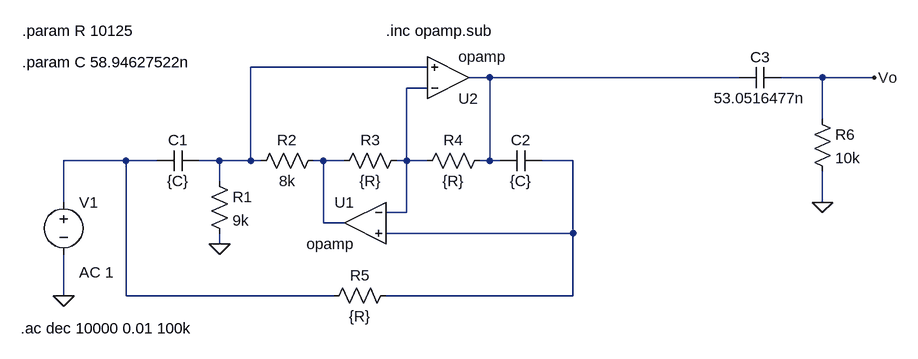
[diagram p0: schematic TS6.asc]
TS6.asc, the LTspice schematic file:
Version 4
SHEET 1 1136 680
WIRE 400 -16 128 -16
WIRE 496 0 464 0
WIRE 880 0 496 0
WIRE 1008 0 944 0
WIRE 1088 0 1008 0
WIRE 400 16 368 16
WIRE 1008 64 1008 0
WIRE -64 128 -160 128
WIRE -16 128 -64 128
WIRE 80 128 48 128
WIRE 128 128 128 -16
WIRE 128 128 80 128
WIRE 144 128 128 128
WIRE 240 128 224 128
WIRE 272 128 240 128
WIRE 368 128 368 16
WIRE 368 128 352 128
WIRE 400 128 368 128
WIRE 496 128 496 0
WIRE 496 128 480 128
WIRE 512 128 496 128
WIRE 624 128 576 128
WIRE 80 160 80 128
WIRE -160 192 -160 128
WIRE 1008 192 1008 144
WIRE 368 208 368 128
WIRE 368 208 336 208
WIRE 240 224 240 128
WIRE 272 224 240 224
WIRE 624 240 624 128
WIRE 624 240 336 240
WIRE 80 256 80 240
WIRE -160 336 -160 272
WIRE -64 336 -64 128
WIRE 256 336 -64 336
WIRE 624 336 624 240
WIRE 624 336 336 336
FLAG 80 256 0
FLAG -160 336 0
FLAG 1008 192 0
FLAG 1088 0 Vo
SYMBOL cap 48 112 R90
WINDOW 0 0 32 VBottom 2
WINDOW 3 32 32 VTop 2
SYMATTR InstName C1
SYMATTR Value {C}
SYMBOL res 64 144 R0
SYMATTR InstName R1
SYMATTR Value 9k
SYMBOL res 240 112 R90
WINDOW 0 0 56 VBottom 2
WINDOW 3 32 56 VTop 2
SYMATTR InstName R2
SYMATTR Value 8k
SYMBOL res 368 112 R90
WINDOW 0 0 56 VBottom 2
WINDOW 3 32 56 VTop 2
SYMATTR InstName R3
SYMATTR Value {R}
SYMBOL res 496 112 R90
WINDOW 0 0 56 VBottom 2
WINDOW 3 32 56 VTop 2
SYMATTR InstName R4
SYMATTR Value {R}
SYMBOL cap 576 112 R90
WINDOW 0 0 32 VBottom 2
WINDOW 3 32 32 VTop 2
SYMATTR InstName C2
SYMATTR Value {C}
SYMBOL res 352 320 R90
WINDOW 0 0 56 VBottom 2
WINDOW 3 32 56 VTop 2
SYMATTR InstName R5
SYMATTR Value {R}
SYMBOL OpAmps\\opamp 304 160 M0
SYMATTR InstName U1
SYMATTR SpiceLine Aol=10000Meg
SYMATTR SpiceLine2 GBW=1000Meg
SYMBOL OpAmps\\opamp 432 64 M180
SYMATTR InstName U2
SYMATTR SpiceLine Aol=10000Meg
SYMATTR SpiceLine2 GBW=1000Meg
SYMBOL voltage -160 176 R0
WINDOW 123 24 124 Left 2
WINDOW 39 0 0 Left 0
SYMATTR InstName V1
SYMATTR Value ""
SYMATTR Value2 AC 1
SYMBOL cap 944 -16 R90
WINDOW 0 0 32 VBottom 2
WINDOW 3 32 32 VTop 2
SYMATTR InstName C3
SYMATTR Value 53.0516477n
SYMBOL res 992 48 R0
SYMATTR InstName R6
SYMATTR Value 10k
TEXT -224 -72 Left 2 !.param R 10125
TEXT -224 -24 Left 2 !.param C 58.94627522n
TEXT -226 386 Left 2 !.ac dec 10000 0.01 100k
TEXT 336 -72 Left 2 !.inc opamp.sub

The netlist it stands for:
* TS6.asc
C1 N001 N004 {C}
R1 N001 0 9k
R2 N005 N001 8k
R3 N003 N005 {R}
R4 N002 N003 {R}
C2 N006 N002 {C}
R5 N006 N004 {R}
XU1 N003 N006 N005 opamp Aol=10000Meg GBW=1000Meg  ; pins invin noninvin out
XU2 N003 N001 N002 opamp Aol=10000Meg GBW=1000Meg  ; pins invin noninvin out
V1 N004 0 AC 1
C3 Vo N002 53.0516477n
R6 Vo 0 10k
.param R 10125
.param C 58.94627522n
.ac dec 10000 0.01 100k
.inc opamp.sub
.backanno
.end